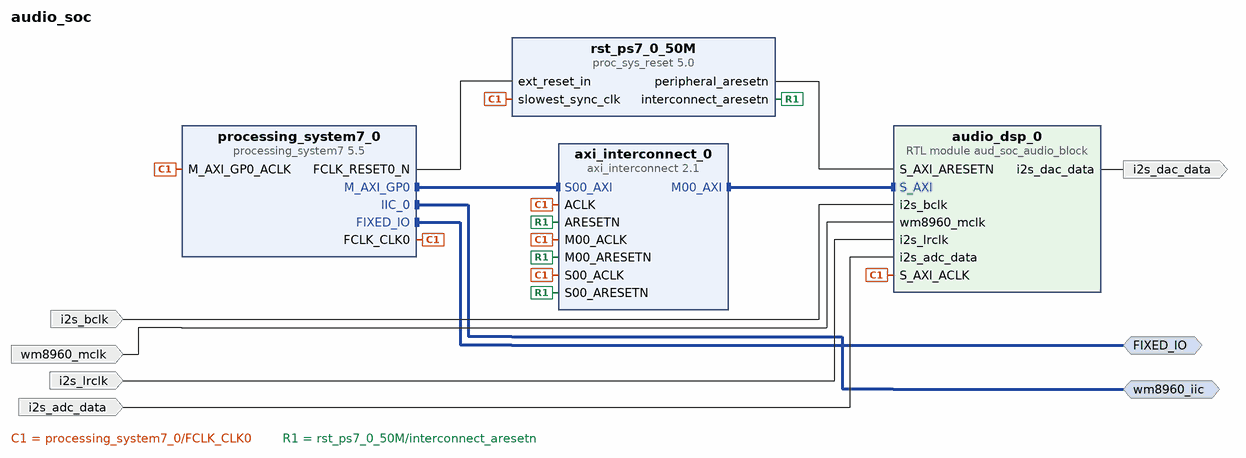
[diagram p0: block diagram of the top level]
# Vivado block design audio_soc, xc7z020clg400-2, Vivado 2018.3
create_bd_design audio_soc

create_bd_intf_port -mode Master -vlnv xilinx.com:display_processing_system7:fixedio_rtl:1.0 FIXED_IO
create_bd_intf_port -mode Master -vlnv xilinx.com:interface:iic_rtl:1.0 wm8960_iic
create_bd_port -dir I -type clk i2s_bclk
set_property -dict {CONFIG.FREQ_HZ 3072000} [get_bd_ports i2s_bclk]
create_bd_port -dir I -type clk wm8960_mclk
set_property -dict {CONFIG.FREQ_HZ 24000000} [get_bd_ports wm8960_mclk]
create_bd_port -dir I i2s_lrclk
create_bd_port -dir I i2s_adc_data
create_bd_port -dir O i2s_dac_data

create_bd_cell -type ip -vlnv xilinx.com:ip:processing_system7:5.5 processing_system7_0
set_property -dict [list \
  CONFIG.PCW_FPGA0_PERIPHERAL_FREQMHZ 50.000000 \
  CONFIG.PCW_I2C0_I2C0_IO EMIO \
  CONFIG.PCW_I2C0_PERIPHERAL_ENABLE 1 \
  CONFIG.PCW_I2C_PERIPHERAL_FREQMHZ 111.111115 \
  CONFIG.PCW_UART1_PERIPHERAL_ENABLE 1 \
  CONFIG.PCW_UART1_UART1_IO {MIO 48 .. 49} \
  CONFIG.PCW_UART_PERIPHERAL_FREQMHZ 100 \
] [get_bd_cells processing_system7_0]
# 47 more settings of processing_system7_0 are not shown: defaults, MIO pin electricals, DDR timing, and values the tool derives
create_bd_cell -type ip -vlnv xilinx.com:ip:axi_interconnect:2.1 axi_interconnect_0
set_property -dict {CONFIG.NUM_MI 1} [get_bd_cells axi_interconnect_0]
create_bd_cell -type ip -vlnv xilinx.com:ip:proc_sys_reset:5.0 rst_ps7_0_50M
create_bd_cell -type module -reference aud_soc_audio_block audio_dsp_0

# ---- connections ----

connect_bd_intf_net [get_bd_intf_ports wm8960_iic] [get_bd_intf_pins processing_system7_0/IIC_0]
connect_bd_intf_net [get_bd_intf_ports FIXED_IO] [get_bd_intf_pins processing_system7_0/FIXED_IO]
connect_bd_intf_net [get_bd_intf_pins processing_system7_0/M_AXI_GP0] [get_bd_intf_pins axi_interconnect_0/S00_AXI]
connect_bd_intf_net [get_bd_intf_pins axi_interconnect_0/M00_AXI] [get_bd_intf_pins audio_dsp_0/S_AXI]
connect_bd_net [get_bd_pins processing_system7_0/FCLK_CLK0] \
  [get_bd_pins processing_system7_0/M_AXI_GP0_ACLK] [get_bd_pins axi_interconnect_0/ACLK] \
  [get_bd_pins axi_interconnect_0/S00_ACLK] [get_bd_pins axi_interconnect_0/M00_ACLK] \
  [get_bd_pins rst_ps7_0_50M/slowest_sync_clk] [get_bd_pins audio_dsp_0/S_AXI_ACLK]
connect_bd_net [get_bd_pins processing_system7_0/FCLK_RESET0_N] [get_bd_pins rst_ps7_0_50M/ext_reset_in]
connect_bd_net [get_bd_pins rst_ps7_0_50M/interconnect_aresetn] \
  [get_bd_pins axi_interconnect_0/ARESETN] [get_bd_pins axi_interconnect_0/S00_ARESETN] \
  [get_bd_pins axi_interconnect_0/M00_ARESETN]
connect_bd_net [get_bd_pins rst_ps7_0_50M/peripheral_aresetn] [get_bd_pins audio_dsp_0/S_AXI_ARESETN]
connect_bd_net [get_bd_ports i2s_bclk] [get_bd_pins audio_dsp_0/i2s_bclk]
connect_bd_net [get_bd_ports wm8960_mclk] [get_bd_pins audio_dsp_0/wm8960_mclk]
connect_bd_net [get_bd_ports i2s_lrclk] [get_bd_pins audio_dsp_0/i2s_lrclk]
connect_bd_net [get_bd_ports i2s_adc_data] [get_bd_pins audio_dsp_0/i2s_adc_data]
connect_bd_net [get_bd_pins audio_dsp_0/i2s_dac_data] [get_bd_ports i2s_dac_data]

# ---- address map ----
assign_bd_address -offset 0x43C00000 -range 64K -target_address_space [get_bd_addr_spaces processing_system7_0/Data] [get_bd_addr_segs audio_dsp_0/S_AXI/reg0]

validate_bd_design
save_bd_design
